# EAGLE design OSIF-mega-large (EAGLE 4.16)
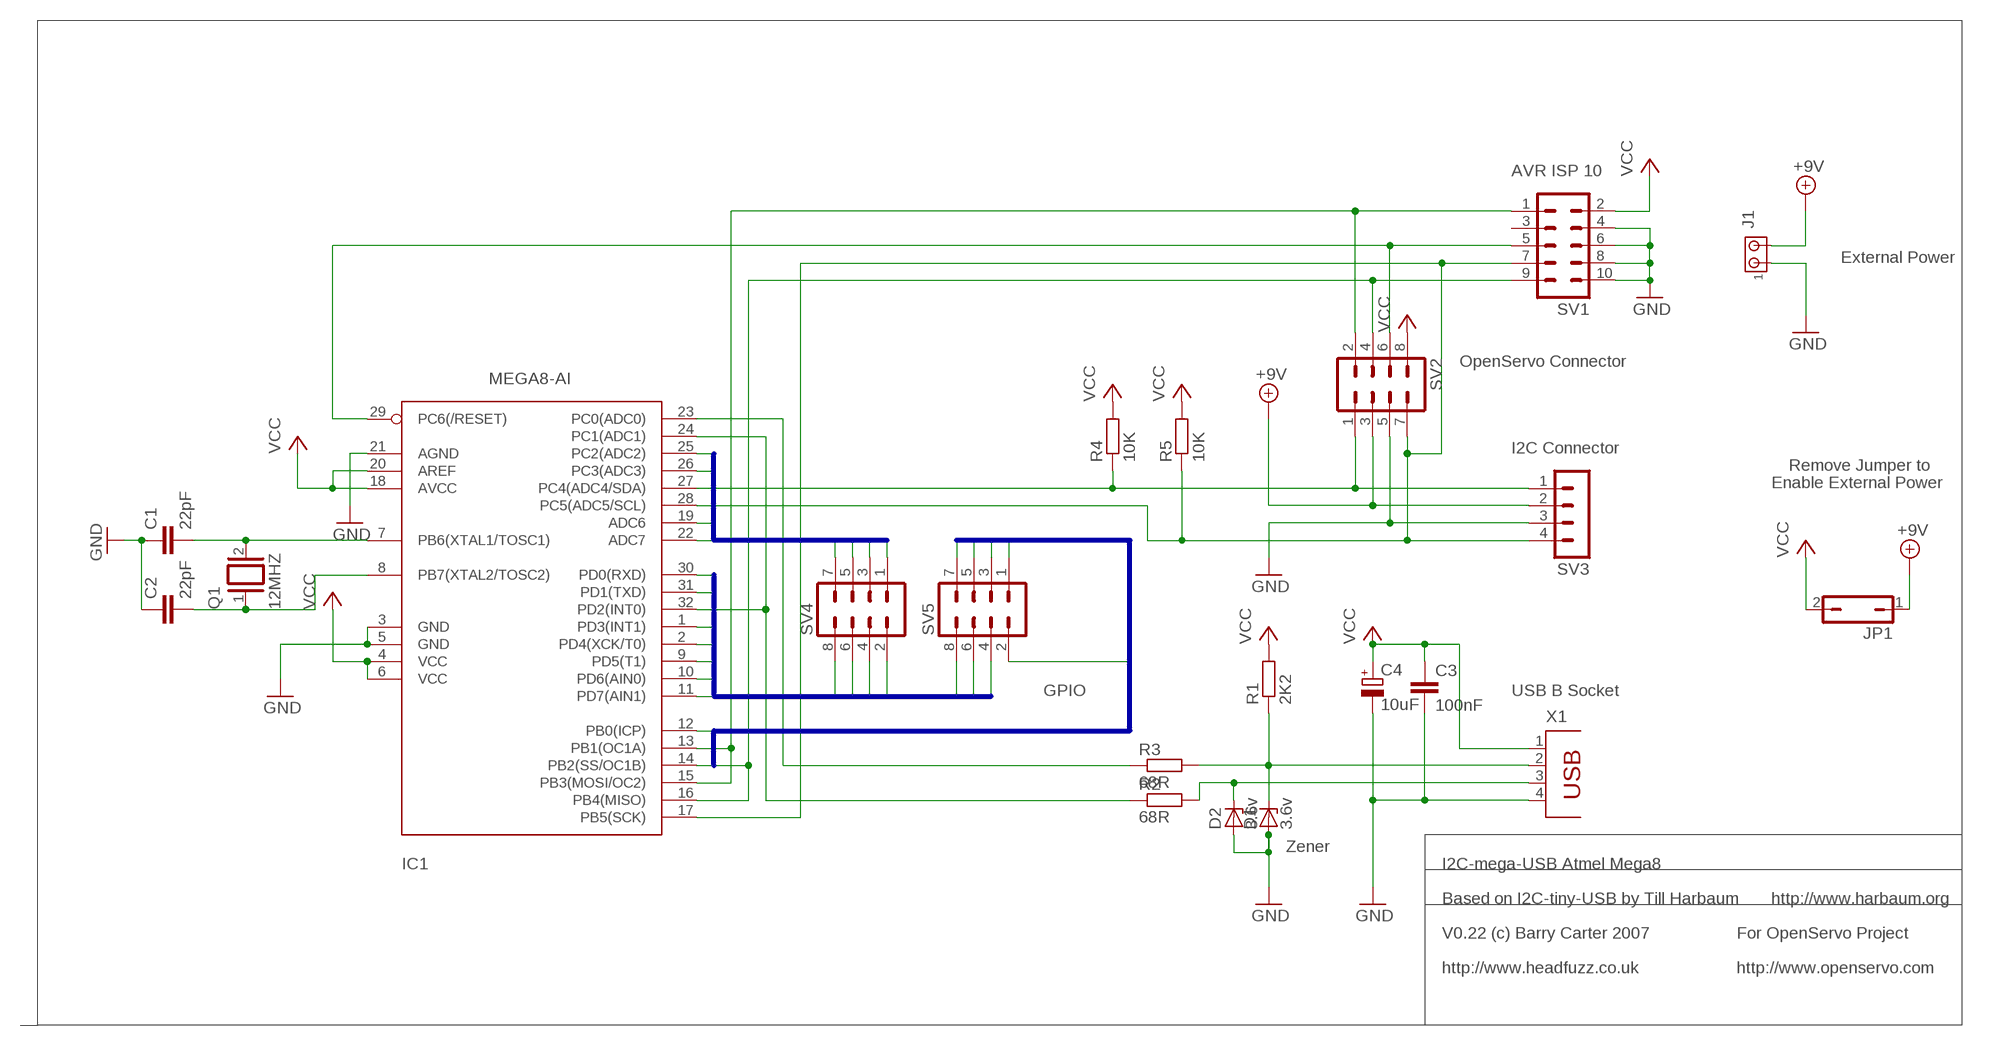
[diagram p0: schematic, sheet 1]

## Parts
C1  22pF  C-EUC0805  [C0805]
C2  22pF  C-EUC0805  [C0805]
C3  100nF  C-EUC0805  [C0805]
C4  10uF  CPOL-EUSMCC  [SMC_C]
D1  3.6v  ZENER-DIODESOT23  [SOT23]
D2  3.6v  ZENER-DIODESOT23  [SOT23]
IC1  MEGA8-AI  [TQFP32-08]
J1  MTA02-100  [10X02MTA]
JP1  JP1Q  [JP1]
Q1  12MHZ  XTAL/S  [QS]
R1  2K2  R-EU_R0805  [R0805]
R2  68R  R-EU_R0805  [R0805]
R3  68R  R-EU_R0805  [R0805]
R4  10K  R-EU_0207/10  [0207/10]
R5  10K  R-EU_0207/10  [0207/10]
SV1  MA05-2  [MA05-2]
SV2  MA04-2  [MA04-2]
SV3  MA04-1  [MA04-1]
SV4  MA04-2  [MA04-2]
SV5  MA04-2  [MA04-2]
X1  PN61729  [PN61729]

## Nets
+9V: J1.2 JP1.1 SV2.3 SV3.2
GND: C1.1 C2.1 C3.2 C4.- D1.1(A) D2.1(A) IC1.3(GND) IC1.5(GND) IC1.21(AGND) J1.1 SV1.4 SV1.6 SV1.8 SV1.10 SV2.5 SV3.3 X1.4
N$1: D2.3(C) R2.2 X1.3
N$2: D1.3(C) R1.1 R3.2 X1.2
N$3: IC1.27(PC4(ADC4/SDA)) R4.1 SV2.1 SV3.1
N$6: C2.2 IC1.8(PB7(XTAL2/TOSC2)) Q1.1
N$7: C1.2 IC1.7(PB6(XTAL1/TOSC1)) Q1.2
N$8: IC1.23(PC0(ADC0)) R3.1
N$9: IC1.24(PC1(ADC1)) IC1.32(PD2(INT0)) R2.1
N$11: IC1.29(PC6(/RESET)) SV1.5 SV2.6
N$12: IC1.17(PB5(SCK)) IC1.28(PC5(ADC5/SCL)) R5.1 SV1.7 SV2.7 SV3.4
PORTB0: IC1.12(PB0(ICP)) SV5.1
PORTB1: IC1.13(PB1(OC1A)) SV5.3
PORTB2: IC1.14(PB2(SS/OC1B)) SV5.5
PORTB3: IC1.15(PB3(MOSI/OC2)) SV1.1 SV2.2 SV5.7
PORTB4: IC1.16(PB4(MISO)) SV1.9 SV2.4 SV5.2
PORTC0: IC1.25(PC2(ADC2)) SV4.1
PORTC1: IC1.26(PC3(ADC3)) SV4.3
PORTC2: IC1.19(ADC6) SV4.5
PORTC3: IC1.22(ADC7) SV4.7
PORTD0: IC1.30(PD0(RXD)) SV5.4
PORTD1: IC1.31(PD1(TXD)) SV5.6
PORTD2: IC1.1(PD3(INT1)) SV5.8
PORTD3: IC1.2(PD4(XCK/T0)) SV4.2
PORTD4: IC1.9(PD5(T1)) SV4.4
PORTD5: IC1.10(PD6(AIN0)) SV4.6
PORTD6: IC1.11(PD7(AIN1)) SV4.8
VCC: C3.1 C4.+ IC1.4(VCC) IC1.6(VCC) IC1.18(AVCC) IC1.20(AREF) JP1.2 R1.2 R4.2 R5.2 SV1.2 SV2.8 X1.1
Unconnected: SV1.3

## Buses
PORTC[0..4]
PORTD[0..7]
PORTB[0..4]

## Notes on the sheet
- AVR ISP 10
- External Power
- OpenServo Connector
- I2C Connector
- Remove Jumper to
- Enable External Power
- GPIO | USB B Socket
- Zener
- I2C-mega-USB Atmel Mega8
- Based on I2C-tiny-USB by Till Harbaum | http://www.harbaum.org
- V0.22 (c) Barry Carter 2007 | For OpenServo Project
- http://www.headfuzz.co.uk | http://www.openservo.com

## Library data of the parts
C1-C3 = rcl:C-EU: CAPACITOR, European symbol
C4 = rcl:CPOL-EU: POLARIZED CAPACITOR, European symbol
D1 D2 = diode:ZENER-DIODE: Z-Diode
IC1 = atmel:MEGA8: MICROCONTROLLER 8 Kbytes FLASH 1 kbytes SRAM 512 bytes EEPROM USART 6-channel 10 bit ADC 2-channel 8 bit ADC Source: avr.lbr
J1 = con-amp:MTA02-100: AMP connector
JP1 = jumper:JP1Q: JUMPER
Q1 = special:XTAL/S: CRYSTAL
R1-R5 = rcl:R-EU_: RESISTOR, European symbol
SV1 = con-lstb:MA05-2: PIN HEADER
SV2 SV4 SV5 = con-lstb:MA04-2: PIN HEADER
SV3 = con-lstb:MA04-1: PIN HEADER
X1 = con-berg:PN61729: BERG USB connector

## Board
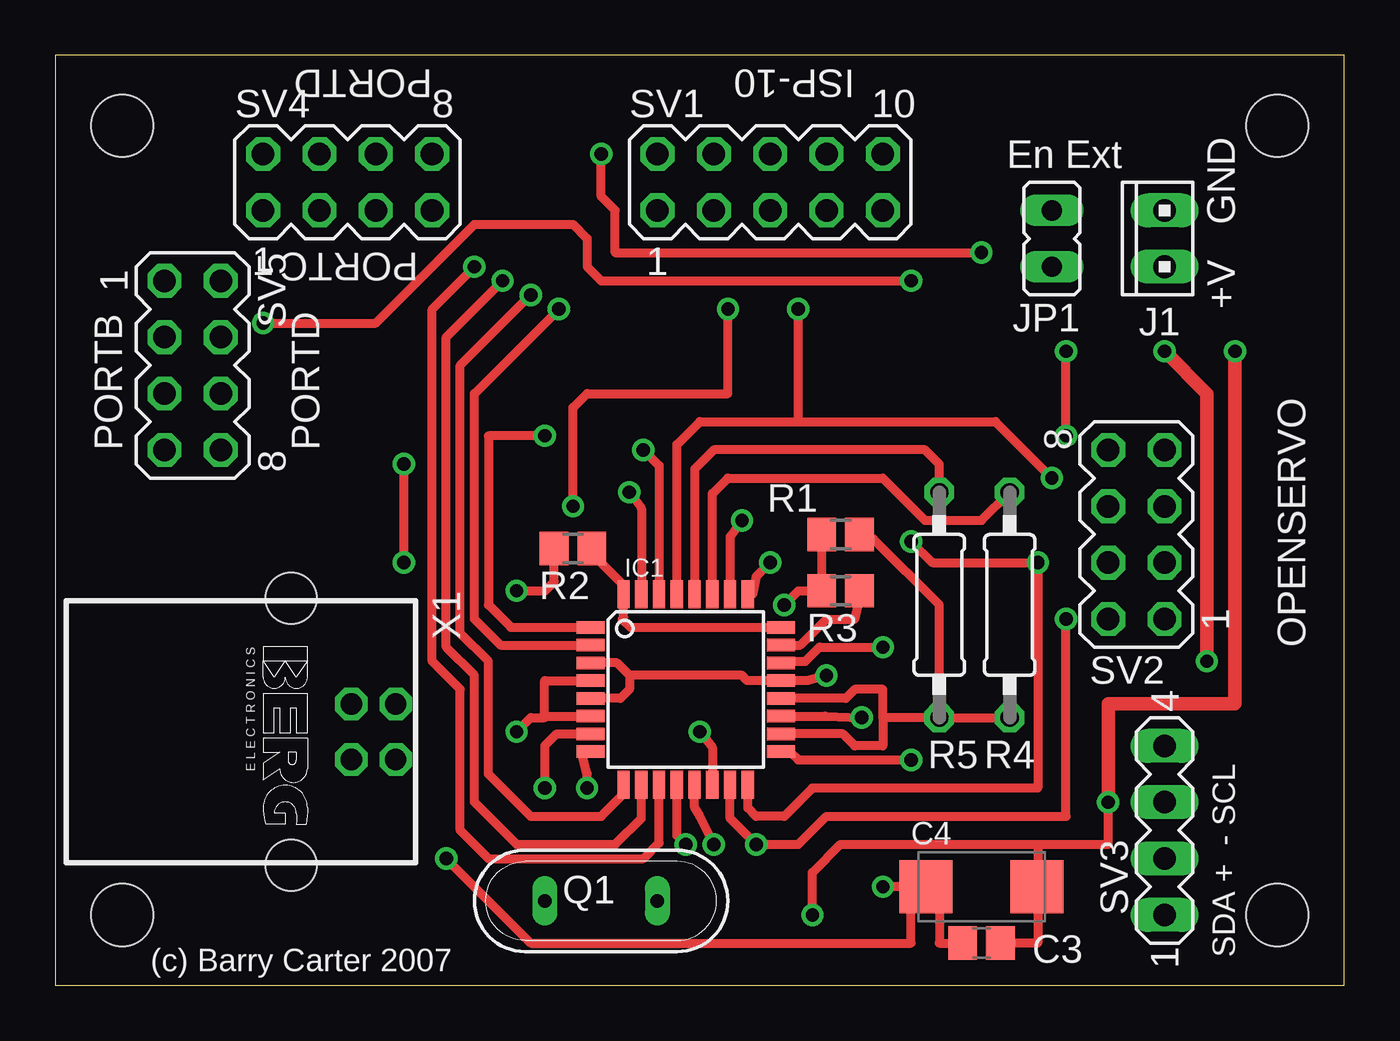
[diagram p1: board, top side]
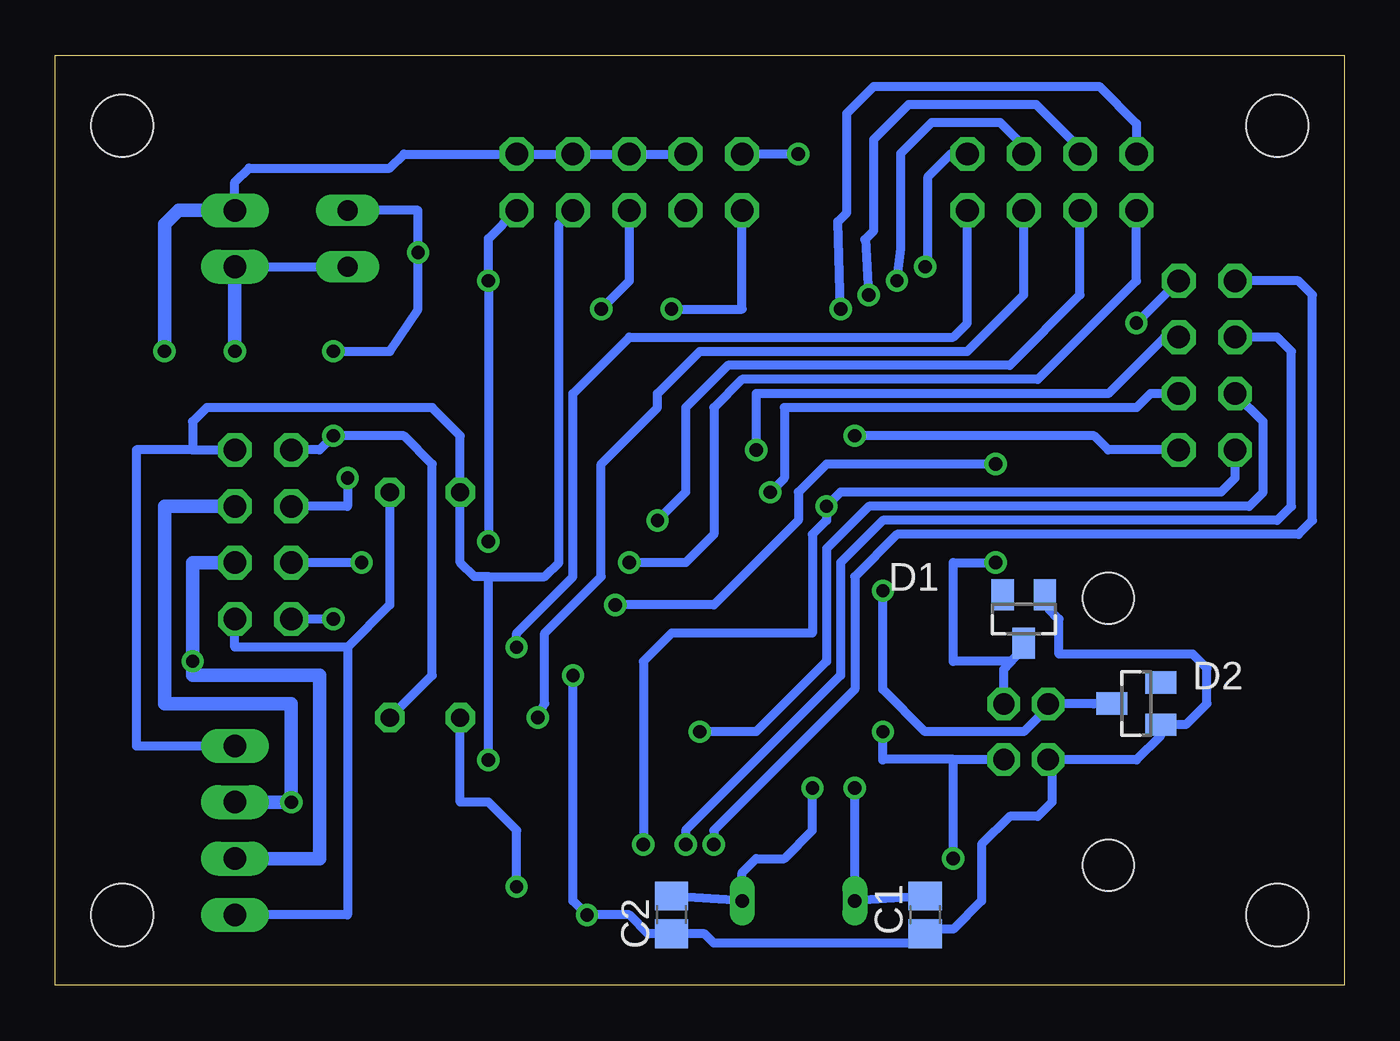
[diagram p2: board, bottom side, seen from below]

Size 58.09 x 41.9 mm. Coordinates in mm from the lower left corner, seen from the top.
Outline: 0,0 58.09,0 58.09,41.9 0,41.9 0,0
Copper layers (1*16): Top 0.035mm / dielectric 1.5mm / Bottom 0.035mm
Design rules "8mils": minimum track width 10mil, minimum drill 8mil, track to track 8mil, track to pad 8mil, pad to pad 8mil, via to via 8mil, smd to smd 8mil, copper to edge 40mil, drill to drill 10mil, minimum pad ring 10mil, minimum via ring 8mil, stop-mask expansion 0mil, vias tented up to drill 0mil, thermal gap 10mil
Holes 2.8 mm at 3.01,38.73 3.01,3.17 55.08,38.73 55.08,3.17

### Footprints (pad centres in the part's own frame; a part is rotated, then mirrored left to right if it is on the bottom)
C0805 = smd 1.3 x 1.5: 1 -0.85,0; 2 0.85,0
SMC_C = smd 2.4 x 2.4: + -2.5,0; - 2.5,0
SOT23 = smd 1 x 1.4: 1 -0.95,-1.1; 2 0.95,-1.1; 3 0,1.1
TQFP32-08 = smd 1.27 x 0.559: 1 -4.293,2.8; 2 -4.293,2; 3 -4.293,1.2; 4 -4.293,0.4; 5 -4.293,-0.4; 6 -4.293,-1.2; 7 -4.293,-2; 8 -4.293,-2.8; 17 4.293,-2.8; 18 4.293,-2; 19 4.293,-1.2; 20 4.293,-0.4; 21 4.293,0.4; 22 4.293,1.2; 23 4.293,2; 24 4.293,2.8 | smd 0.559 x 1.27: 9 -2.8,-4.293; 10 -2,-4.293; 11 -1.2,-4.293; 12 -0.4,-4.293; 13 0.4,-4.293; 14 1.2,-4.293; 15 2,-4.293; 16 2.8,-4.293; 25 2.8,4.293; 26 2,4.293; 27 1.2,4.293; 28 0.4,4.293; 29 -0.4,4.293; 30 -1.2,4.293; 31 -2,4.293; 32 -2.8,4.293
10X02MTA = drill 1.016 long: 1 1.27,0; 2 -1.27,0
JP1 = drill 0.914 long: 1 0,-1.27; 2 0,1.27
QS = drill 0.61 long: 1 -2.54,0; 2 2.54,0
R0805 = smd 1.3 x 1.5: 1 -0.85,0; 2 0.85,0
0207/10 = drill 0.813 octagon: 1 -5.08,0; 2 5.08,0
MA05-2 = drill 1.016 octagon: 1 -5.08,-1.27; 2 -5.08,1.27; 3 -2.54,-1.27; 4 -2.54,1.27; 5 0,-1.27; 6 0,1.27; 7 2.54,-1.27; 8 2.54,1.27; 9 5.08,-1.27; 10 5.08,1.27
MA04-2 = drill 1.016 octagon: 1 -3.81,-1.27; 2 -3.81,1.27; 3 -1.27,-1.27; 4 -1.27,1.27; 5 1.27,-1.27; 6 1.27,1.27; 7 3.81,-1.27; 8 3.81,1.27
MA04-1 = drill 1.016 long: 1 -3.81,0; 2 -1.27,0; 3 1.27,0; 4 3.81,0
PN61729 = drill 0.95 octagon: 1 1.25,4.71; 2 -1.25,4.71; 3 -1.25,2.71; 4 1.25,2.71 | hole 2.3: -6.02,0; 6.02,0

### Placement (x,y rotation side)
C1  18.89,3.17 90 bottom
C2  30.32,3.17 90 bottom
C3  41.74,1.9 0 top
C4  41.74,4.44 0 top
D1  14.44,16.51 180 bottom
D2  9.36,12.69 90 bottom
IC1  28.41,13.33 0 top
J1  50,33.65 90 top
JP1  44.92,33.65 0 top
Q1  24.6,3.81 180 top
R1  35.4,20.32 0 top
R2  23.33,19.68 180 top
R3  35.4,17.78 180 top
R4  43.02,17.14 270 top
R5  39.84,17.14 270 top
SV1  32.22,36.19 0 top
SV2  48.73,20.32 90 top
SV3  50,6.98 90 top
SV4  13.17,36.19 0 top
SV5  6.18,27.94 270 top
X1  10.63,11.42 270 top

### Tracks (layer width: path | path; a pad name or v marks a point on that pad's centre or on a via)
+9V  (via drill 0.6)
  Top 0.61: v51.91,14.6 51.91,26.67 v50,28.57
  Bottom 0.254: J1.2 48.73,32.38
  Bottom 0.406: J1.2 JP1.1
  Bottom 0.61: SV2.3 51.91,19.05 v51.91,14.6 51.91,13.96 46.19,13.96 46.19,5.71 SV3.2 | v50,28.57 J1.2
GND  (via drill 0.6)
  Top 0.406: C3.2 44.29,1.9 44.29,4.44 | 44.29,6.34 47.46,6.34 v47.46,8.25 | 44.29,4.44 C4.- | 44.29,6.34 44.29,4.44 | 44.29,6.34 35.4,6.34 34.12,5.08 v34.12,3.17 | v34.76,13.96 33.89,13.73 IC1.21 31.19,13.73 30.95,13.96 25.87,13.96 | IC1.5 25.47,12.93 25.87,13.33 25.87,13.96 | IC1.3 25.3,14.53 25.87,13.96
  Top 0.61: v53.18,28.57 53.18,12.69 47.46,12.69 v47.46,8.25
  Bottom 0.406: 13.17,10.15 13.17,8.25 13.81,7.62 15.08,7.62 16.35,6.34 16.35,3.81 17.62,2.54 18.67,2.54 C1.1 18.89,2.54 19.52,1.9 28.41,1.9 28.83,2.32 C2.1 31.37,2.32 32.22,3.17 v34.12,3.17 34.76,3.81 v34.76,13.96 | SV1.4 SV1.6 SV1.8 SV1.10 42.38,37.46 43.02,36.82 49.37,36.82 50,36.19 J1.1 | 13.17,10.15 13.19,10.17 X1.4 | 13.17,10.15 9.36,10.15 8.26,11.25 D2.1 7.13,11.74 6.18,12.69 6.18,14.28 6.82,14.92 12.85,14.92 12.85,16.51 13.32,16.97 D1.1
  Bottom 0.61: SV3.3 v47.46,8.25 47.46,12.69 53.18,12.69 53.18,21.59 SV2.5 | J1.1 52.54,34.92 53.18,34.28 v53.18,28.57
N$1  (via drill 0.6)
  Top 0.406: R2.2 22.48,18.2 22.06,17.78 v20.79,17.78
  Bottom 0.406: D2.3 10.63,12.69 11.29,12.67 13.15,12.67 | v20.79,17.78 20.79,13.33 18.89,11.42 14.44,11.42 13.17,12.69 13.15,12.67 | X1.3 13.15,12.67
N$2  (via drill 0.6)
  Top 0.406: R1.1 R3.2 33.49,17.78 v32.86,17.14 | v15.71,19.05 v15.71,23.49
  Bottom 0.406: X1.2 15.34,14.23 15.04,14.57 | 15.04,14.57 14.44,15.23 D1.3 | v32.86,17.14 28.41,17.14 24.6,20.95 24.6,22.22 23.33,23.49 v15.71,23.49 | 15.04,14.57 15.08,14.6 17.62,14.6 17.62,19.05 v15.71,19.05
N$3
  Top 0.406: R4.1 41.74,20.95 39.2,20.95 37.3,22.86 30.32,22.86 29.61,22.15 IC1.27
  Bottom 0.406: SV3.1 44.92,3.17 44.92,15.23 | SV2.1 50,15.23 44.92,15.23 | R4.1 43.02,17.14 44.92,15.23
N$6  (via drill 0.6)
  Top 0.406: IC1.8 23.71,10.53 23.96,9.52 v23.96,8.88
  Bottom 0.406: v23.96,8.88 23.96,6.98 25.23,5.71 26.51,5.71 27.14,5.08 Q1.1 C2.2
N$7  (via drill 0.6)
  Top 0.406: IC1.7 22.6,11.33 22.06,10.79 v22.06,8.88
  Bottom 0.406: v22.06,8.88 Q1.2 C1.2
N$8
  Top 0.406: IC1.23 33.59,15.33 34.76,16.51 36.03,16.51 36.24,17.36 R3.1
N$9
  Top 0.406: R2.1 24.6,19.05 25.61,18.04 IC1.32 25.61,16.56 25.55,16.51 25.93,16.13 IC1.24
N$11  (via drill 0.6)
  Top 0.406: 33.49,25.39 29.05,25.39 28.01,24.36 IC1.29 | 33.49,25.39 42.38,25.39 v44.92,22.86 | 33.49,25.39 v33.49,30.48
  Bottom 0.406: v44.92,22.86 44.92,21.59 SV2.6 | SV1.5 32.22,31.75 v33.49,30.48
N$12  (via drill 0.6)
  Top 0.406: IC1.28 28.81,23.26 29.68,24.12 39.2,24.12 39.84,23.49 R5.1 | IC1.17 33.12,10.53 33.49,10.15 v38.57,10.15
  Bottom 0.406: SV3.4 54.45,10.79 54.45,24.12 51.91,24.12 | 51.91,24.12 SV2.7 | 51.91,24.12 51.91,25.39 51.27,26.03 41.11,26.03 39.84,24.76 R5.1 39.84,19.05 39.2,18.41 38.57,18.41 | SV1.7 35.4,34.28 35.4,19.05 36.03,18.41 38.57,18.41 | v38.57,10.15 38.57,18.41
PORTB0  (via drill 0.6)
  Top 0.406: IC1.12 28.01,6.75 v28.41,6.34
  Bottom 0.406: SV5.1 2.06,31.75 1.42,31.11 1.42,20.95 2.06,20.32 20.16,20.32 22.06,18.41 22.06,13.33 28.41,6.98 v28.41,6.34
PORTB1  (via drill 0.6)
  Top 0.406: v29.68,6.34 29.05,7.62 28.81,8.01 IC1.13
  Bottom 0.406: SV5.3 3.01,29.21 2.38,28.57 2.38,21.59 3.01,20.95 20.79,20.95 22.7,19.05 22.7,13.96 29.68,6.98 v29.68,6.34
PORTB2  (via drill 0.6)
  Top 0.406: IC1.14 29.61,10.72 v29.05,11.42
  Bottom 0.406: SV5.5 3.65,25.39 3.65,22.22 4.28,21.59 21.43,21.59 23.33,19.68 23.33,14.6 26.51,11.42 v29.05,11.42
PORTB3  (via drill 0.6)
  Top 0.406: IC1.15 30.41,7.52 v31.59,6.34 33.49,6.34 34.76,7.62 45.55,7.62 v45.55,16.51 | v30.32,30.48 30.32,26.67 23.96,26.67 23.33,26.03 v23.33,21.59
  Bottom 0.406: SV5.7 4.92,22.86 5.55,22.22 22.7,22.22 v23.33,21.59 23.33,20.95 23.96,20.32 23.96,15.87 30.32,15.87 31.59,14.6 v31.59,6.34 | SV1.1 27.14,30.48 v30.32,30.48 | v45.55,16.51 SV2.2
PORTB4  (via drill 0.6)
  Top 0.406: IC1.16 31.21,7.99 31.59,7.62 32.86,7.62 34.12,8.88 44.29,8.88 v44.29,19.05 39.52,19.05 v38.57,20 | v9.36,29.84 14.44,29.84 18.89,34.28 23.33,34.28 23.96,33.65 23.96,32.38 24.6,31.75 v38.57,31.75
  Bottom 0.406: v38.57,20 v38.57,31.75 38.57,33.65 SV1.9 | v44.29,19.05 SV2.4 | SV5.2 v9.36,29.84
PORTC0  (via drill 0.6)
  Top 0.406: IC1.25 31.43,17.62 31.59,18.41 v32.22,19.05
  Bottom 0.406: SV4.1 9.36,31.75 13.81,27.3 27.14,27.3 28.41,26.03 28.41,20.32 29.68,19.05 v32.22,19.05
PORTC1  (via drill 0.6)
  Top 0.406: IC1.26 30.41,20.22 v30.95,20.95
  Bottom 0.406: SV4.3 11.9,31.11 15.08,27.94 27.78,27.94 29.68,26.03 29.68,22.22 v30.95,20.95
PORTC2  (via drill 0.6)
  Top 0.406: IC1.19 34.69,12.13 v36.35,12.06
  Bottom 0.406: SV4.5 14.44,31.11 16.98,28.57 29.05,28.57 30.95,26.67 30.95,26.03 33.49,23.49 33.49,18.41 36.03,15.87 36.03,12.69 v36.35,12.06
PORTC3  (via drill 0.6)
  Top 0.406: IC1.22 32.79,14.53 32.86,14.6 33.81,14.6 34.44,15.23 v37.3,15.23
  Bottom 0.406: SV4.7 16.98,29.84 17.62,29.21 32.22,29.21 34.76,26.67 34.76,18.41 37.3,15.87 v37.3,15.23
PORTD0  (via drill 0.6)
  Top 0.406: IC1.30 27.21,23.42 v26.51,24.12
  Bottom 0.406: SV5.4 8.09,29.21 10.63,26.67 26.51,26.67 v26.51,24.12
PORTD1  (via drill 0.6)
  Top 0.406: IC1.31 26.41,21.49 v25.87,22.22
  Bottom 0.406: SV5.6 8.73,26.67 9.36,26.03 25.23,26.03 25.23,22.86 v25.87,22.22
PORTD2  (via drill 0.6)
  Top 0.406: v22.06,24.76 19.52,24.76 19.52,17.14 20.53,16.13 IC1.1
  Bottom 0.406: SV5.8 10.63,24.12 11.27,24.76 v22.06,24.76
PORTD3  (via drill 0.6)
  Top 0.406: IC1.2 20.06,15.33 18.89,16.51 18.89,26.67 v22.7,30.48
  Bottom 0.406: SV4.2 9.36,38.83 11.04,40.51 21.2,40.51 22.42,39.29 22.42,34.82 22.82,34.41 v22.7,30.48
PORTD4  (via drill 0.6)
  Top 0.406: IC1.9 25.61,8.62 24.6,7.62 21.43,7.62 19.52,9.52 19.52,14.6 18.25,15.87 18.25,27.94 v21.43,31.11
  Bottom 0.406: SV4.4 11.9,37.71 13.88,39.7 19.62,39.7 21.2,38.12 21.2,34.01 21.55,33.65 | 21.55,33.65 21.6,33.6 | v21.43,31.11 21.55,33.65
PORTD5  (via drill 0.6)
  Top 0.406: IC1.10 26.41,7.52 25.23,6.34 20.79,6.34 18.89,8.25 18.89,13.96 17.62,15.23 17.62,29.21 v20.16,31.75
  Bottom 0.406: SV4.6 14.44,37.82 15.51,38.88 18.58,38.88 19.98,37.48 19.98,33.19 v20.16,31.75
PORTD6  (via drill 0.6)
  Top 0.406: IC1.11 27.21,6.42 26.51,5.71 19.52,5.71 18.25,6.98 18.25,13.33 16.98,14.6 16.98,30.48 v18.89,32.38
  Bottom 0.406: SV4.8 17.74,37.46 18.76,36.44 18.76,32.38 v18.89,32.38
VCC  (via drill 0.6)
  Top 0.254: 22.06,12.06 22.06,12.13 | C4.+ 39.84,4.44
  Top 0.406: IC1.4 22.06,13.73 22.06,12.13 IC1.6 | IC1.18 35.49,11.33 36.03,10.79 37.3,10.79 37.3,12.06 | 37.3,12.06 37.3,13.33 36.03,13.33 35.63,12.93 IC1.20 | R5.2 37.3,12.06 | R5.2 R4.2 | 22.06,12.06 21.43,12.06 v20.79,11.42 | 39.84,4.44 39.84,1.9 C3.1 | 38.57,4.44 C4.+ | 38.57,4.44 38.57,1.9 21.43,1.9 v17.62,5.71 | v45.55,24.76 v45.55,28.57 | R1.2 36.24,20.1 36.88,20.1 39.84,17.14 R5.2 | 38.57,4.44 v37.3,4.44 | v24.6,37.46 24.6,35.55 25.23,34.92 25.23,33.02 v41.74,33.02
  Bottom 0.406: JP1.2 41.74,34.92 v41.74,33.02 41.74,30.48 43.02,28.57 v45.55,28.57 | 17.62,10.17 X1.1 | 17.62,10.17 20.77,10.17 20.79,10.15 v20.79,11.42 | v17.62,5.71 17.62,10.17 | SV2.8 46.19,24.12 v45.55,24.76 42.38,24.76 41.11,23.49 41.11,13.96 R4.2 | v37.3,4.44 37.3,6.98 38.57,8.25 39.84,8.25 R5.2 | v24.6,37.46 SV1.2

### Text on the board
tPlace: PORTD | ISP-10 | En Ext | GND | PORTC | +V | PORTB | PORTD | OPENSERVO | SDA + - SCL
tNames: (c) Barry Carter 2007
tDocu: 1 | Ext Pwr